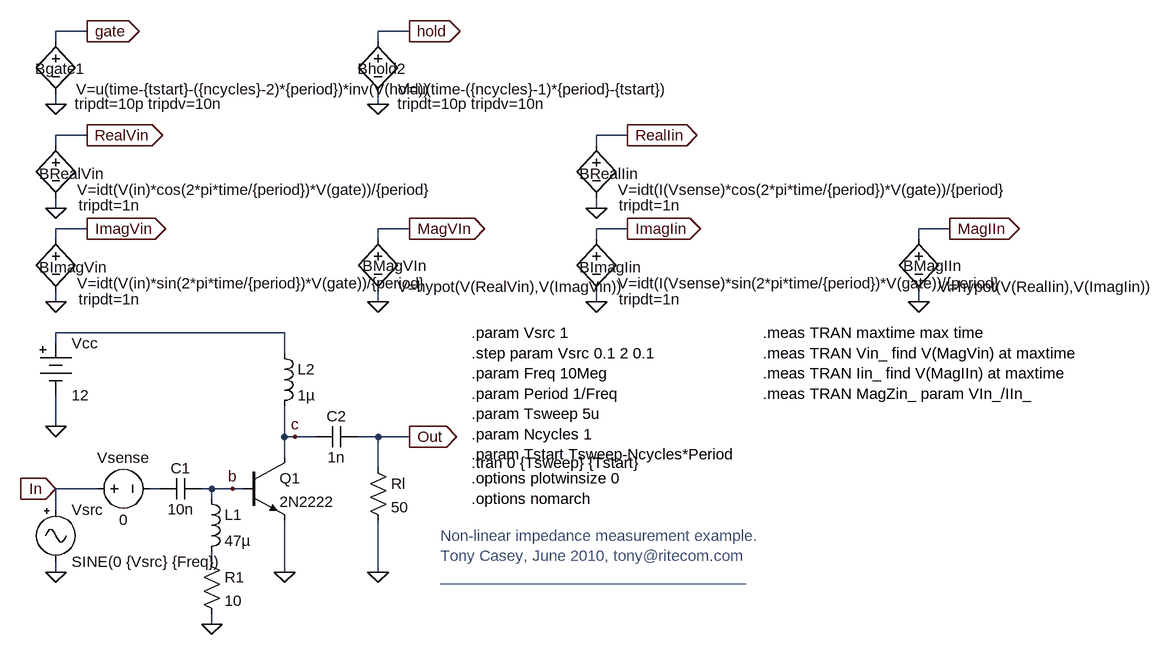
[diagram p0: schematic ClassC_amp.asc]
ClassC_amp.asc, the LTspice schematic file:
Version 4
SHEET 1 1688 680
WIRE -16 -528 -64 -528
WIRE 480 -528 432 -528
WIRE -64 -512 -64 -528
WIRE 432 -512 432 -528
WIRE -64 -416 -64 -432
WIRE 432 -416 432 -432
WIRE -16 -368 -64 -368
WIRE 816 -368 768 -368
WIRE -64 -352 -64 -368
WIRE 768 -352 768 -368
WIRE -64 -256 -64 -272
WIRE 768 -256 768 -272
WIRE -16 -224 -64 -224
WIRE 480 -224 432 -224
WIRE 816 -224 768 -224
WIRE 1312 -224 1264 -224
WIRE -64 -208 -64 -224
WIRE 432 -208 432 -224
WIRE 768 -208 768 -224
WIRE 1264 -208 1264 -224
WIRE -64 -112 -64 -128
WIRE 432 -112 432 -128
WIRE 768 -112 768 -128
WIRE 1264 -112 1264 -128
WIRE 288 -64 -64 -64
WIRE -64 -48 -64 -64
WIRE 288 -32 288 -64
WIRE -64 80 -64 32
WIRE 288 96 288 48
WIRE 304 96 288 96
WIRE 336 96 304 96
WIRE 432 96 400 96
WIRE 480 96 432 96
WIRE 288 128 288 96
WIRE 432 144 432 96
WIRE 0 176 -64 176
WIRE 96 176 80 176
WIRE 176 176 160 176
WIRE 208 176 176 176
WIRE 224 176 208 176
WIRE 176 192 176 176
WIRE -64 208 -64 176
WIRE 176 288 176 272
WIRE -64 304 -64 288
WIRE 288 304 288 224
WIRE 432 304 432 224
WIRE 176 384 176 368
FLAG 288 304 0
FLAG 176 384 0
FLAG -64 304 0
FLAG -64 80 0
FLAG 432 304 0
FLAG 480 96 Out
IOPIN 480 96 Out
FLAG -64 176 In
IOPIN -64 176 In
FLAG 208 176 b
FLAG 304 96 c
FLAG -64 -256 0
FLAG -16 -368 RealVin
IOPIN -16 -368 Out
FLAG -16 -528 gate
IOPIN -16 -528 Out
FLAG -64 -416 0
FLAG -64 -112 0
FLAG -16 -224 ImagVin
IOPIN -16 -224 Out
FLAG 480 -224 MagVIn
IOPIN 480 -224 Out
FLAG 432 -112 0
FLAG 480 -528 hold
IOPIN 480 -528 Out
FLAG 432 -416 0
FLAG 768 -256 0
FLAG 816 -368 RealIin
IOPIN 816 -368 Out
FLAG 768 -112 0
FLAG 816 -224 ImagIin
IOPIN 816 -224 Out
FLAG 1312 -224 MagIIn
IOPIN 1312 -224 Out
FLAG 1264 -112 0
SYMBOL npn 224 128 R0
SYMATTR InstName Q1
SYMATTR Value 2N2222
SYMBOL Misc\\signal -64 192 R0
WINDOW 123 0 0 Left 2
WINDOW 39 24 128 Left 2
SYMATTR InstName Vsrc
SYMATTR Value SINE(0 {Vsrc} {Freq})
SYMBOL cap 96 192 R270
WINDOW 0 32 32 VTop 2
WINDOW 3 0 32 VBottom 2
SYMATTR InstName C1
SYMATTR Value 10n
SYMBOL ind 160 176 R0
SYMATTR InstName L1
SYMATTR Value 47µ
SYMBOL res 160 272 R0
SYMATTR InstName R1
SYMATTR Value 10
SYMBOL ind 272 -48 R0
SYMATTR InstName L2
SYMATTR Value 1µ
SYMBOL cap 400 80 R90
WINDOW 0 0 32 VBottom 2
WINDOW 3 32 32 VTop 2
SYMATTR InstName C2
SYMATTR Value 1n
SYMBOL res 416 128 R0
SYMATTR InstName Rl
SYMATTR Value 50
SYMBOL Misc\\battery -64 -64 R0
SYMATTR InstName Vcc
SYMATTR Value 12
SYMBOL voltage -16 176 R270
WINDOW 0 32 56 VTop 2
WINDOW 3 -32 56 VBottom 2
SYMATTR InstName Vsense
SYMATTR Value 0
SYMBOL bv -64 -368 R0
WINDOW 0 -26 59 Left 2
WINDOW 3 33 84 Left 2
WINDOW 123 35 108 Left 2
SYMATTR InstName BRealVin
SYMATTR Value V=idt(V(in)*cos(2*pi*time/{period})*V(gate))/{period}
SYMATTR Value2 tripdt=1n
SYMBOL bv -64 -528 R0
WINDOW 0 -32 58 Left 2
WINDOW 3 31 89 Left 2
WINDOW 123 29 112 Left 2
SYMATTR InstName Bgate1
SYMATTR Value V=u(time-{tstart}-({ncycles}-2)*{period})*inv(V(hold))
SYMATTR Value2 tripdt=10p tripdv=10n
SYMBOL bv -64 -224 R0
WINDOW 0 -26 59 Left 2
WINDOW 3 33 84 Left 2
WINDOW 123 35 108 Left 2
SYMATTR InstName BImagVin
SYMATTR Value V=idt(V(in)*sin(2*pi*time/{period})*V(gate))/{period}
SYMATTR Value2 tripdt=1n
SYMBOL bv 432 -224 R0
WINDOW 0 -24 57 Left 2
WINDOW 3 30 89 Left 2
SYMATTR InstName BMagVIn
SYMATTR Value V=hypot(V(RealVin),V(ImagVin))
SYMBOL bv 432 -528 R0
WINDOW 0 -32 58 Left 2
WINDOW 3 31 89 Left 2
WINDOW 123 30 112 Left 2
SYMATTR InstName Bhold2
SYMATTR Value V=u(time-({ncycles}-1)*{period}-{tstart})
SYMATTR Value2 tripdt=10p tripdv=10n
SYMBOL bv 768 -368 R0
WINDOW 0 -26 59 Left 2
WINDOW 3 33 84 Left 2
WINDOW 123 35 108 Left 2
SYMATTR InstName BRealIin
SYMATTR Value V=idt(I(Vsense)*cos(2*pi*time/{period})*V(gate))/{period}
SYMATTR Value2 tripdt=1n
SYMBOL bv 768 -224 R0
WINDOW 0 -26 59 Left 2
WINDOW 3 33 84 Left 2
WINDOW 123 35 108 Left 2
SYMATTR InstName BImagIin
SYMATTR Value V=idt(I(Vsense)*sin(2*pi*time/{period})*V(gate))/{period}
SYMATTR Value2 tripdt=1n
SYMBOL bv 1264 -224 R0
WINDOW 0 -24 57 Left 2
WINDOW 3 30 89 Left 2
SYMATTR InstName BMagIIn
SYMATTR Value V=hypot(V(RealIin),V(ImagIin))
TEXT 576 -64 Left 2 !.param Vsrc 1\n.step param Vsrc 0.1 2 0.1\n.param Freq 10Meg\n.param Period 1/Freq\n.param Tsweep 5u\n.param Ncycles 1\n.param Tstart Tsweep-Ncycles*Period
TEXT 576 136 Left 2 !.tran 0 {Tsweep} {Tstart}
TEXT 1024 -64 Left 2 !.meas TRAN maxtime max time\n.meas TRAN Vin_ find V(MagVin) at maxtime\n.meas TRAN Iin_ find V(MagIIn) at maxtime\n.meas TRAN MagZin_ param VIn_/IIn_
TEXT 576 160 Left 2 !.options plotwinsize 0\n.options nomarch
TEXT 528 248 Left 2 ;Non-linear impedance measurement example.\nTony Casey, June 2010, tony@ritecom.com\n____________________________________

The netlist it stands for:
* ClassC_amp.asc
Q1 c b 0 0 2N2222
Vsrc In 0 SINE(0 {Vsrc} {Freq})
C1 N002 b 10n
L1 b N003 47µ
R1 N003 0 10
L2 N001 c 1µ
C2 Out c 1n
Rl Out 0 50
Vcc N001 0 12
Vsense In N002 0
BRealVin RealVin 0 V=idt(V(in)*cos(2*pi*time/{period})*V(gate))/{period} tripdt=1n
Bgate1 gate 0 V=u(time-{tstart}-({ncycles}-2)*{period})*inv(V(hold)) tripdt=10p tripdv=10n
BImagVin ImagVin 0 V=idt(V(in)*sin(2*pi*time/{period})*V(gate))/{period} tripdt=1n
BMagVIn MagVIn 0 V=hypot(V(RealVin),V(ImagVin))
Bhold2 hold 0 V=u(time-({ncycles}-1)*{period}-{tstart}) tripdt=10p tripdv=10n
BRealIin RealIin 0 V=idt(I(Vsense)*cos(2*pi*time/{period})*V(gate))/{period} tripdt=1n
BImagIin ImagIin 0 V=idt(I(Vsense)*sin(2*pi*time/{period})*V(gate))/{period} tripdt=1n
BMagIIn MagIIn 0 V=hypot(V(RealIin),V(ImagIin))
.model NPN NPN
.model PNP PNP
.lib standard.bjt
.param Vsrc 1
.step param Vsrc 0.1 2 0.1
.param Freq 10Meg
.param Period 1/Freq
.param Tsweep 5u
.param Ncycles 1
.param Tstart Tsweep-Ncycles*Period
.tran 0 {Tsweep} {Tstart}
.meas TRAN maxtime max time
.meas TRAN Vin_ find V(MagVin) at maxtime
.meas TRAN Iin_ find V(MagIIn) at maxtime
.meas TRAN MagZin_ param VIn_/IIn_
.options plotwinsize 0
.options nomarch
* Non-linear impedance measurement example.
* Tony Casey, June 2010, tony@ritecom.com
* ____________________________________
.backanno
.end